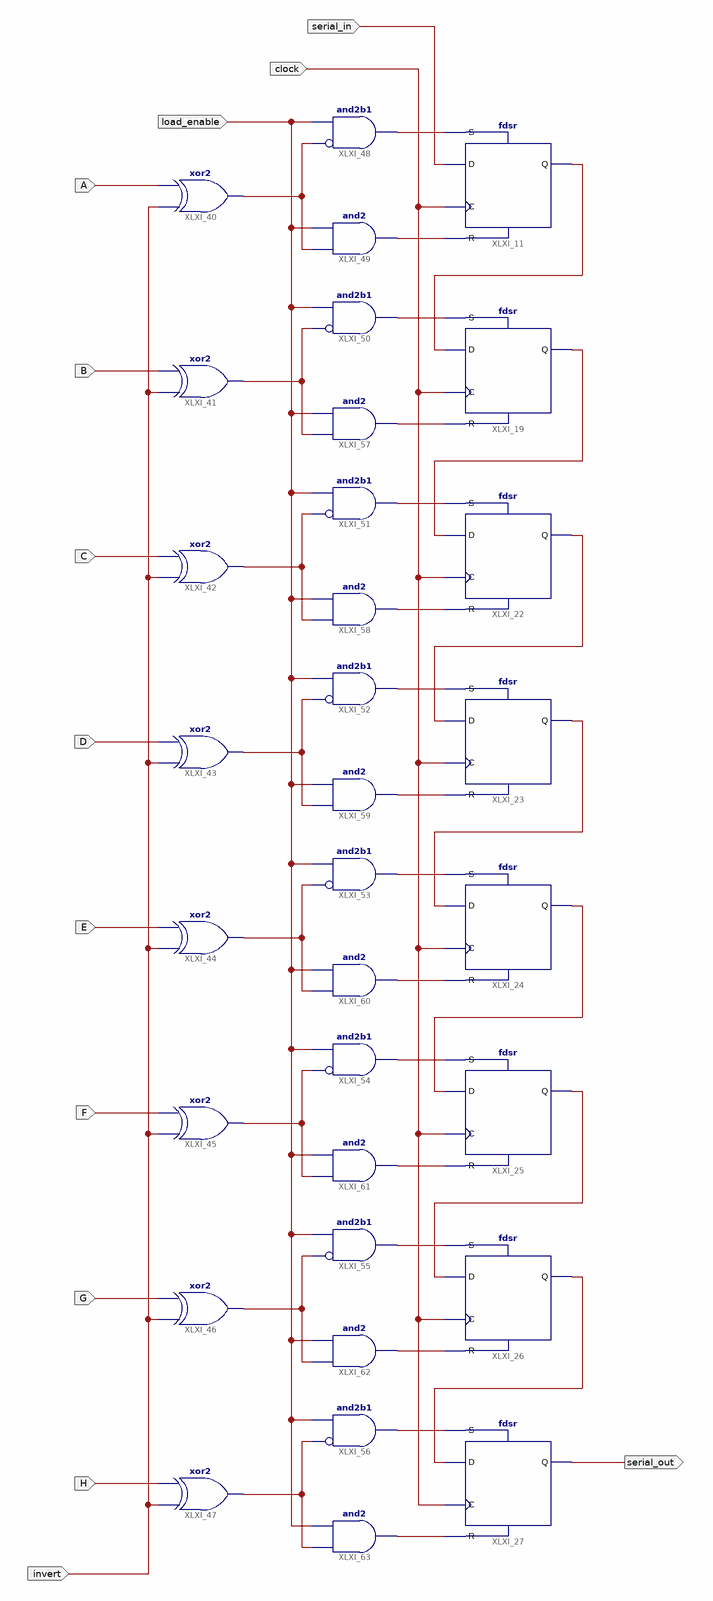
[diagram p0: schematic sheet 1]
// Xilinx ISE schematic piso_register.sch (xc9500) as structural Verilog: 32 symbols, 13 ports
module piso_register (
  input  clock,
  input  serial_in,
  input  load_enable,
  input  invert,
  input  A,
  input  B,
  input  C,
  input  D,
  input  E,
  input  F,
  input  G,
  input  H,
  output serial_out
);

  wire XLXN_24, XLXN_25, XLXN_26, XLXN_31, XLXN_32, XLXN_34, XLXN_35, XLXN_36, XLXN_37, XLXN_38, XLXN_39,
       XLXN_40, XLXN_41, XLXN_42, XLXN_43, XLXN_44, XLXN_45, XLXN_77, XLXN_79, XLXN_81, XLXN_83, XLXN_85,
       XLXN_87, XLXN_89, XLXN_92, XLXN_94, XLXN_96, XLXN_98, XLXN_100, XLXN_102, XLXN_105;

  fdsr XLXI_11 (.C(clock), .D(serial_in), .R(XLXN_25), .S(XLXN_24), .Q(XLXN_26));
  fdsr XLXI_19 (.C(clock), .D(XLXN_26), .R(XLXN_32), .S(XLXN_31), .Q(XLXN_77));
  fdsr XLXI_22 (.C(clock), .D(XLXN_77), .R(XLXN_35), .S(XLXN_34), .Q(XLXN_79));
  fdsr XLXI_23 (.C(clock), .D(XLXN_79), .R(XLXN_37), .S(XLXN_36), .Q(XLXN_81));
  fdsr XLXI_24 (.C(clock), .D(XLXN_81), .R(XLXN_39), .S(XLXN_38), .Q(XLXN_83));
  fdsr XLXI_25 (.C(clock), .D(XLXN_83), .R(XLXN_41), .S(XLXN_40), .Q(XLXN_85));
  fdsr XLXI_26 (.C(clock), .D(XLXN_85), .R(XLXN_43), .S(XLXN_42), .Q(XLXN_87));
  fdsr XLXI_27 (.C(clock), .D(XLXN_87), .R(XLXN_45), .S(XLXN_44), .Q(serial_out));
  xor XLXI_40 (XLXN_89, invert, A);
  xor XLXI_41 (XLXN_92, invert, B);
  xor XLXI_42 (XLXN_94, invert, C);
  xor XLXI_43 (XLXN_96, invert, D);
  xor XLXI_44 (XLXN_98, invert, E);
  xor XLXI_45 (XLXN_100, invert, F);
  xor XLXI_46 (XLXN_102, invert, G);
  xor XLXI_47 (XLXN_105, invert, H);
  and XLXI_48 (XLXN_24, ~XLXN_89, load_enable);  // and2b1
  and XLXI_49 (XLXN_25, XLXN_89, load_enable);
  and XLXI_50 (XLXN_31, ~XLXN_92, load_enable);  // and2b1
  and XLXI_51 (XLXN_34, ~XLXN_94, load_enable);  // and2b1
  and XLXI_52 (XLXN_36, ~XLXN_96, load_enable);  // and2b1
  and XLXI_53 (XLXN_38, ~XLXN_98, load_enable);  // and2b1
  and XLXI_54 (XLXN_40, ~XLXN_100, load_enable);  // and2b1
  and XLXI_55 (XLXN_42, ~XLXN_102, load_enable);  // and2b1
  and XLXI_56 (XLXN_44, ~XLXN_105, load_enable);  // and2b1
  and XLXI_57 (XLXN_32, XLXN_92, load_enable);
  and XLXI_58 (XLXN_35, XLXN_94, load_enable);
  and XLXI_59 (XLXN_37, XLXN_96, load_enable);
  and XLXI_60 (XLXN_39, XLXN_98, load_enable);
  and XLXI_61 (XLXN_41, XLXN_100, load_enable);
  and XLXI_62 (XLXN_43, XLXN_102, load_enable);
  and XLXI_63 (XLXN_45, XLXN_105, load_enable);
endmodule
